# EAGLE design esrmeter (EAGLE 6.2)
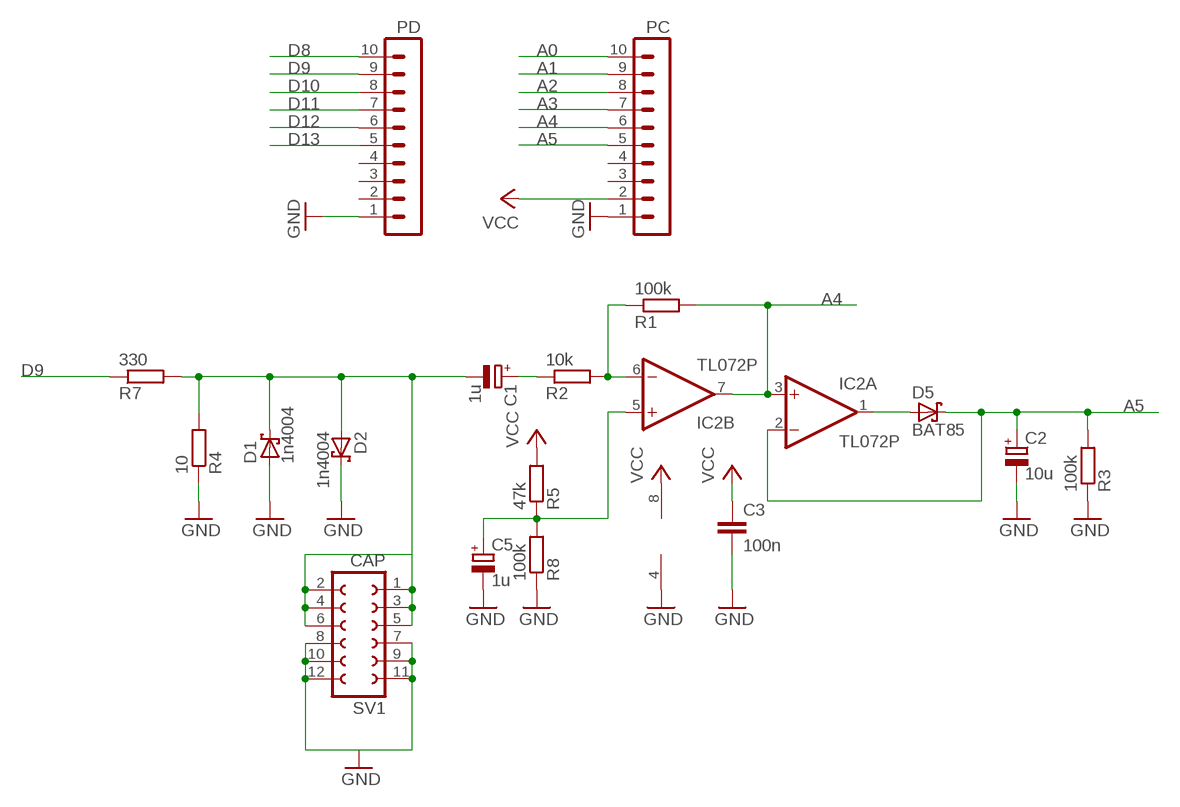
[diagram p0: schematic, sheet 1]

## Parts
C1  1u  CPOL-EUTT2D6  [TT2D6]
C2  10u  CPOL-EUTT5D7  [TT5D7]
C3  100n  C-EU025-024X044  [C025-024X044]
C5  1u  CPOL-EUTT5D7  [TT5D7]
D1  1n4004  SCHOTTKY-DIODETO92H  [TO92H]
D2  1n4004  SCHOTTKY-DIODETO92H  [TO92H]
D5  BAT85  SCHOTTKY-DIODETO92H  [TO92H]
IC2  TL072P  [DIL08]
PC  MA10-1W  [MA10-1W]
PD  MA10-1W  [MA10-1W]
R1  100k  R-EU_0207/2V  [0207/2V]
R2  10k  R-EU_0617/17  [0617/17]
R3  100k  R-EU_0207/10  [0207/10]
R4  10  R-EU_0207/2V  [0207/2V]
R5  47k  R-EU_0207/2V  [0207/2V]
R7  330  R-EU_0617/22  [0617/22]
R8  100k  R-EU_0204/5  [0204/5]
SV1  CAP  FE06-2W  [FE06-2W]

## Nets
A0: PC.10
A1: PC.9
A2: PC.8
A3: PC.7
A4: IC2.3(A:+IN) IC2.7(B:OUT) PC.6 R1.2
A5: C2.+ D5.2(C) IC2.2(A:-IN) PC.5 R3.2
D8: PD.10
D9: PD.9 R7.1
D10: PD.8
D11: PD.7
D12: PD.6
D13: PD.5
GND: C2.- C3.2 C5.- D1.1(A) D2.2(C) IC2.4(P:V-) PC.1 PD.1 R3.1 R4.1 R8.1 SV1.7 SV1.8 SV1.9 SV1.10 SV1.11 SV1.12
N$1: C1.- D1.2(C) D2.1(A) R4.2 R7.2 SV1.1 SV1.2 SV1.3 SV1.4 SV1.5 SV1.6
N$2: C1.+ R2.1
N$3: IC2.6(B:-IN) R1.1 R2.2
N$5: D5.1(A) IC2.1(A:OUT)
N$7: C5.+ IC2.5(B:+IN) R5.1 R8.2
VCC: C3.1 IC2.8(P:V+) PC.2 R5.2
Unconnected: PC.3 PC.4 PD.2 PD.3 PD.4

## Library data of the parts
C1 C2 C5 = rcl:CPOL-EU: POLARIZED CAPACITOR, European symbol
C3 = rcl:C-EU: CAPACITOR, European symbol
D1 D2 D5 = diode:SCHOTTKY-DIODE: Schottky Diode
IC2 = linear:TL072: OP AMP
PC PD = con-lstb:MA10-1W: PIN HEADER
R1-R5 R7 R8 = rcl:R-EU_: RESISTOR, European symbol
SV1 = con-lsta:FE06-2W: FEMALE HEADER; OC_FARNELL: unknown; OC_NEWARK: unknown

## Board
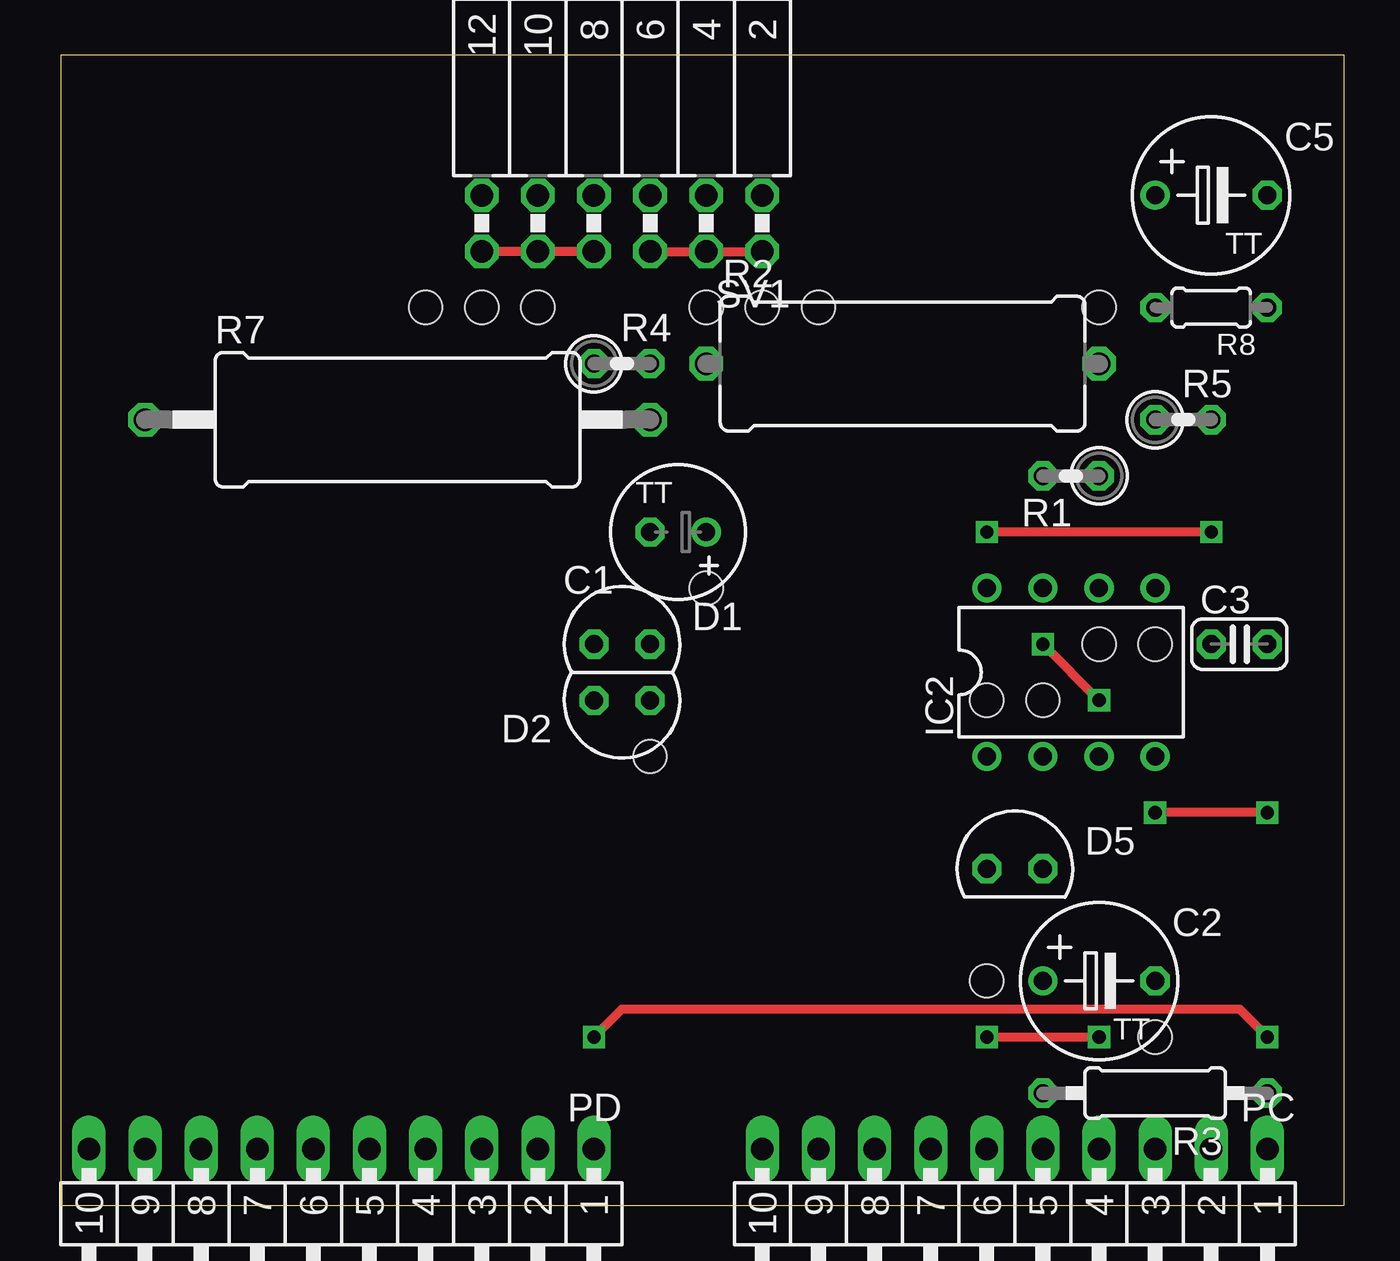
[diagram p1: board, top side]
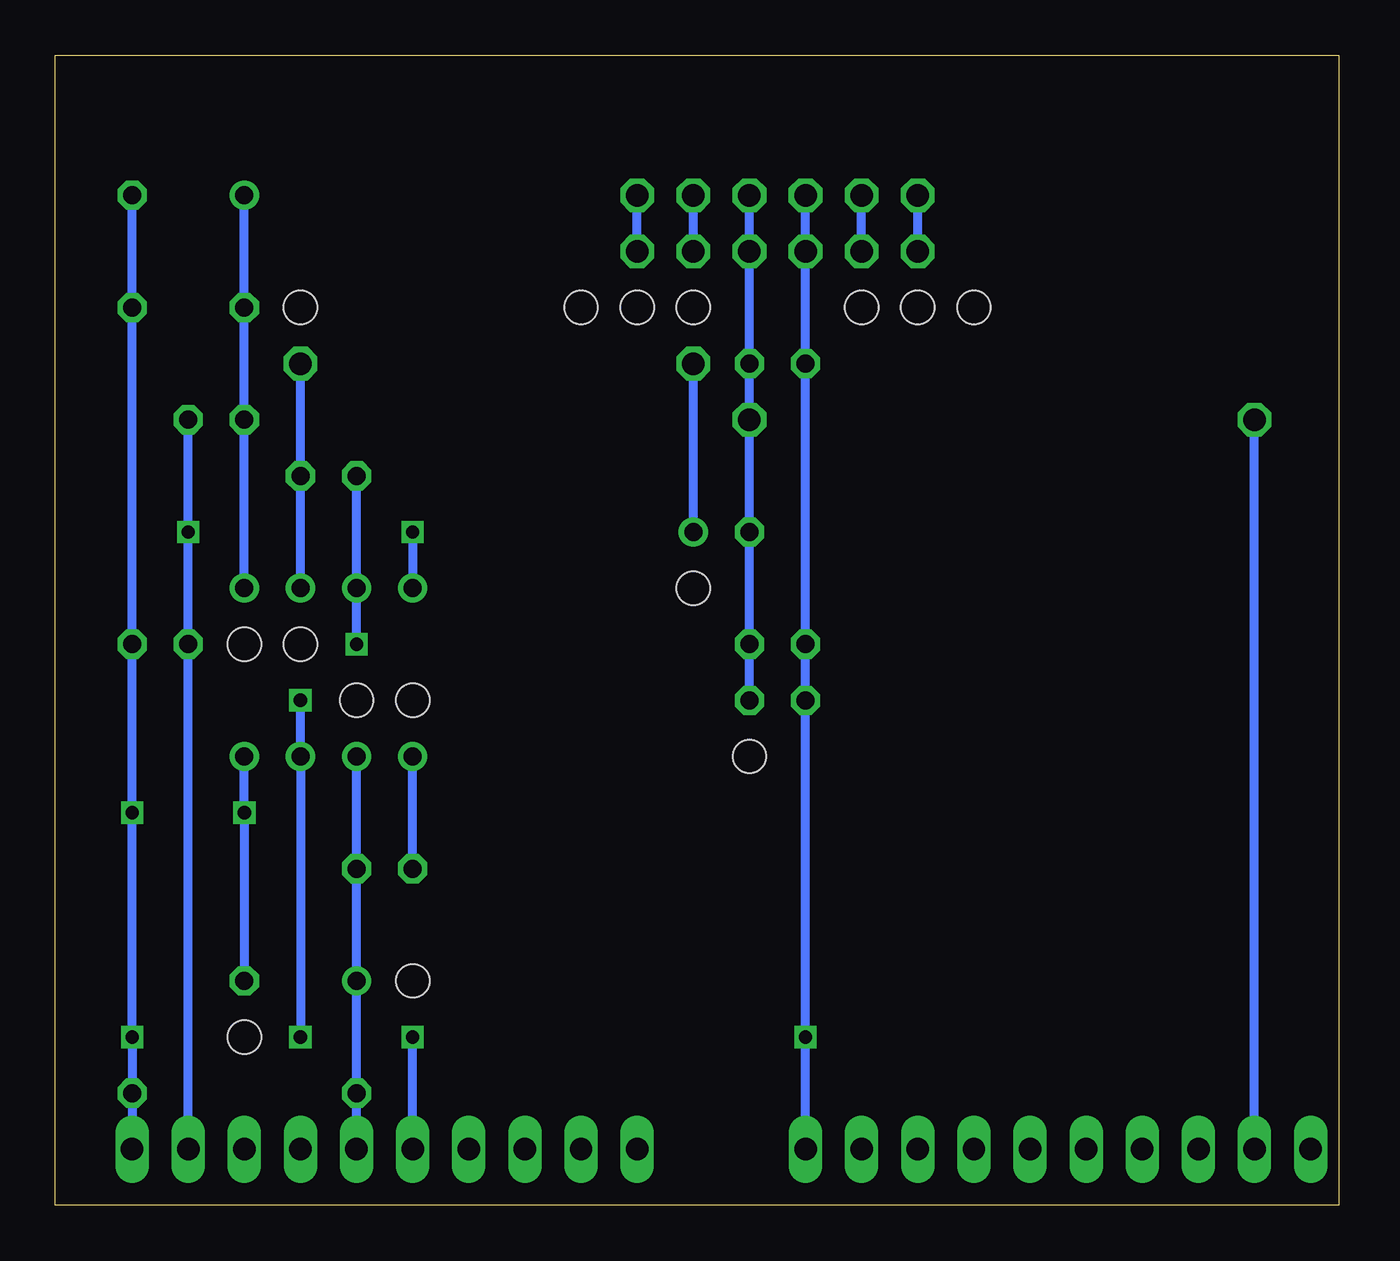
[diagram p2: board, bottom side, seen from below]

Size 58.09 x 52.06 mm. Coordinates in mm from the lower left corner, seen from the top.
Outline: 0,0 58.09,0 58.09,52.06 0,52.06 0,0
Copper layers (1*16): Top 0.035mm / dielectric 1.5mm / Bottom 0.035mm
Design rules: minimum track width 10mil, minimum drill 24mil, track to track 8mil, track to pad 8mil, pad to pad 8mil, via to via 8mil, smd to smd 8mil, copper to edge 40mil, drill to drill 8mil, minimum pad ring 10mil, minimum via ring 8mil, stop-mask expansion 4mil, vias tented up to drill 0mil, thermal gap 10mil
Holes 1.5 mm at 26.67,20.32 44.45,22.86 41.91,22.86 46.99,25.4 49.53,25.4 49.53,7.62 19.05,40.64 21.59,40.64 29.21,40.64 29.21,27.94 46.99,40.64 41.91,10.16 31.75,40.64 16.51,40.64 34.29,40.64

### Footprints (pad centres in the part's own frame; a part is rotated, then mirrored left to right if it is on the bottom)
TT2D6 = drill 0.813: + -1.27,0 | drill 0.813 octagon: - 1.27,0
TT5D7 = drill 0.813: + -2.54,0 | drill 0.813 octagon: - 2.54,0
C025-024X044 = drill 0.813 octagon: 1 -1.27,0; 2 1.27,0
TO92H = drill 0.813 octagon: 1 -1.27,0; 2 1.27,0
DIL08 = drill 0.813 pad 1.27: 1 -3.81,-3.81; 2 -1.27,-3.81; 3 1.27,-3.81; 4 3.81,-3.81; 5 3.81,3.81; 6 1.27,3.81; 7 -1.27,3.81; 8 -3.81,3.81
MA10-1W = drill 1.016 long: 1 -11.43,0; 2 -8.89,0; 3 -6.35,0; 4 -3.81,0; 5 -1.27,0; 6 1.27,0; 7 3.81,0; 8 6.35,0; 9 8.89,0; 10 11.43,0
0207/2V = drill 0.813 octagon: 1 -1.27,0; 2 1.27,0
0617/17 = drill 1.016 octagon: 1 -8.89,0; 2 8.89,0
0207/10 = drill 0.813 octagon: 1 -5.08,0; 2 5.08,0
0617/22 = drill 1.016 octagon: 1 -11.43,0; 2 11.43,0
0204/5 = drill 0.813 octagon: 1 -2.54,0; 2 2.54,0
FE06-2W = drill 1.016 octagon: 1 -6.35,1.27; 2 -6.35,-1.27; 3 -3.81,1.27; 4 -3.81,-1.27; 5 -1.27,1.27; 6 -1.27,-1.27; 7 1.27,1.27; 8 1.27,-1.27; 9 3.81,1.27; 10 3.81,-1.27; 11 6.35,1.27; 12 6.35,-1.27

### Placement (x,y rotation side)
C1  27.94,30.48 180 top
C2  46.99,10.16 0 top
C3  53.34,25.4 0 top
C5  52.07,45.72 0 top
D1  25.4,25.4 0 top
D2  25.4,22.86 180 top
D5  43.18,15.24 0 top
IC2  45.72,24.13 0 top
PC  43.18,2.54 180 top
PD  12.7,2.54 180 top
R1  45.72,33.02 180 top
R2  38.1,38.1 0 top
R3  49.53,5.08 180 top
R4  25.4,38.1 0 top
R5  50.8,35.56 0 top
R7  15.24,35.56 0 top
R8  52.07,40.64 180 top
SV1  25.4,44.45 180 top

### Tracks (layer width: path | path; a pad name or v marks a point on that pad's centre or on a via)
A4  (via drill 0.6)
  Top 0.406: v46.99,22.86 v44.45,25.4 | v41.91,7.62 v46.99,7.62
  Bottom 0.406: R1.2 IC2.7 v44.45,25.4 | v46.99,22.86 IC2.3 v46.99,7.62 | PC.6 v41.91,7.62
A5
  Bottom 0.406: PC.5 R3.2 C2.+ D5.2 IC2.2
D9  (via drill 0.6)
  Bottom 0.406: PD.9 R7.1
  other vias: 3.81,35.56
GND  (via drill 0.6)
  Top 0.406: v54.61,17.78 v49.53,17.78 | v24.13,7.62 25.4,8.89 53.34,8.89 v54.61,7.62 | SV1.11 SV1.9 SV1.7
  Bottom 0.406: PC.1 R3.1 v54.61,7.62 v54.61,17.78 C3.2 R8.1 C5.- | IC2.4 v49.53,17.78 C2.- | PD.1 v24.13,7.62 D2.2 D1.1 R4.1 SV1.7 SV1.8 | SV1.9 SV1.10 | SV1.11 SV1.12
N$1
  Top 0.406: SV1.5 SV1.3 SV1.1
  Bottom 0.406: C1.- D2.1 D1.2 R7.2 R4.2 SV1.5 SV1.6 | SV1.3 SV1.4 | SV1.1 SV1.2
N$2
  Bottom 0.406: C1.+ R2.1
N$3
  Bottom 0.406: IC2.6 R1.1 R2.2
N$5
  Bottom 0.406: D5.1 IC2.1
N$7
  Bottom 0.406: C5.+ R8.2 R5.1 IC2.5
VCC  (via drill 0.6)
  Top 0.406: v52.07,30.48 v41.91,30.48
  Bottom 0.406: PC.2 C3.1 v52.07,30.48 R5.2 | v41.91,30.48 IC2.8

### Text on the board
Document: VCC | GND | VCC | GND
doc_purple: Capacitor | A4 | ESR METER | D9 | A5